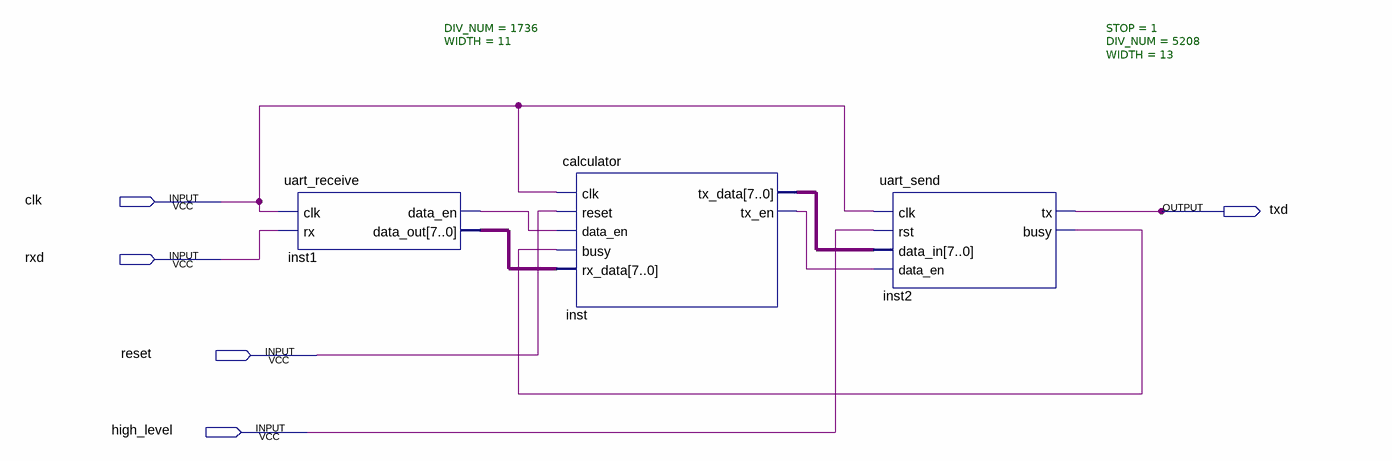
[diagram p0: schematic sheet]
// Quartus schematic Block1.bdf as structural Verilog: 3 symbols, 5 pins
module Block1 (
  input  clk,
  input  rxd,
  input  reset,
  input  high_level,
  output txd
);

  wire inst1_data_en, inst2_busy, inst_tx_en;
  wire [7:0] inst1_data_out, inst_tx_data;

  uart_receive #(.DIV_NUM(1736), .WIDTH(11)) inst1 (
    .clk(clk), .rx(rxd), .data_en(inst1_data_en), .data_out(inst1_data_out));
  calculator inst (
    .clk(clk), .reset(reset), .data_en(inst1_data_en), .busy(inst2_busy), .rx_data(inst1_data_out),
    .tx_data(inst_tx_data), .tx_en(inst_tx_en));
  uart_send #(.STOP(1), .DIV_NUM(5208), .WIDTH(13)) inst2 (
    .clk(clk), .rst(high_level), .data_in(inst_tx_data), .data_en(inst_tx_en), .tx(txd), .busy(inst2_busy));
endmodule
